# EAGLE schematic full1bitAdder (EAGLE 9.6.2)
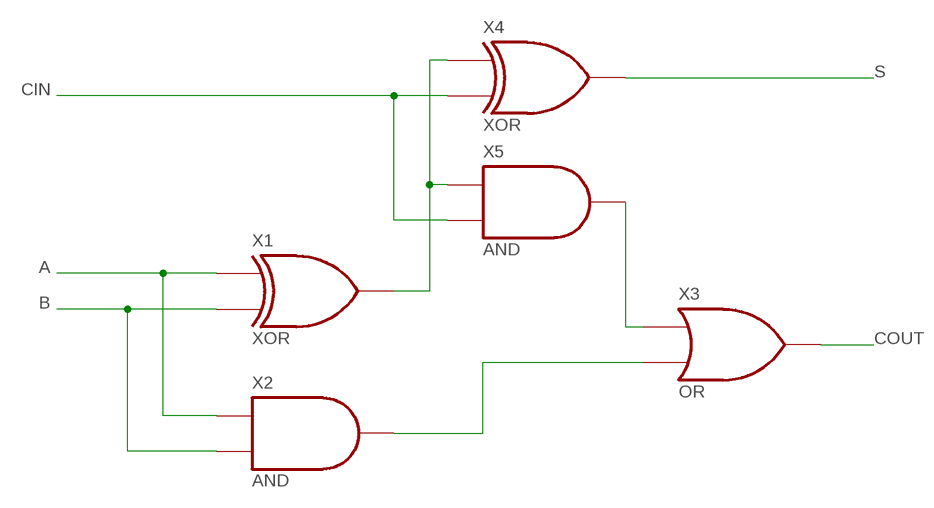
[diagram p0: schematic, sheet 1]

## Parts
X1  XOR  (no package)
X2  AND  (no package)
X3  OR  (no package)
X4  XOR  (no package)
X5  AND  (no package)

## Nets
A: X1.A X2.A
B: X1.B X2.B
CIN: X4.B X5.B
COUT: X3.Y
N$1: X2.Y X3.B
N$2: X3.A X5.Y
N$3: X1.Y X4.A X5.A
S: X4.Y

## Library data of the parts
X1 X4 = ngspice-digital:XOR: 2 input XOR gate
X2 X5 = ngspice-digital:AND: 2 input logic AND gate
X3 = ngspice-digital:OR: 2 input logic OR gate